# Altium schematic sheet Optical_RX.SchDoc
size A4; Organization: UltraZohm; SheetNumber: 3; SheetTotal: 3; Website: www.ultrazohm.com
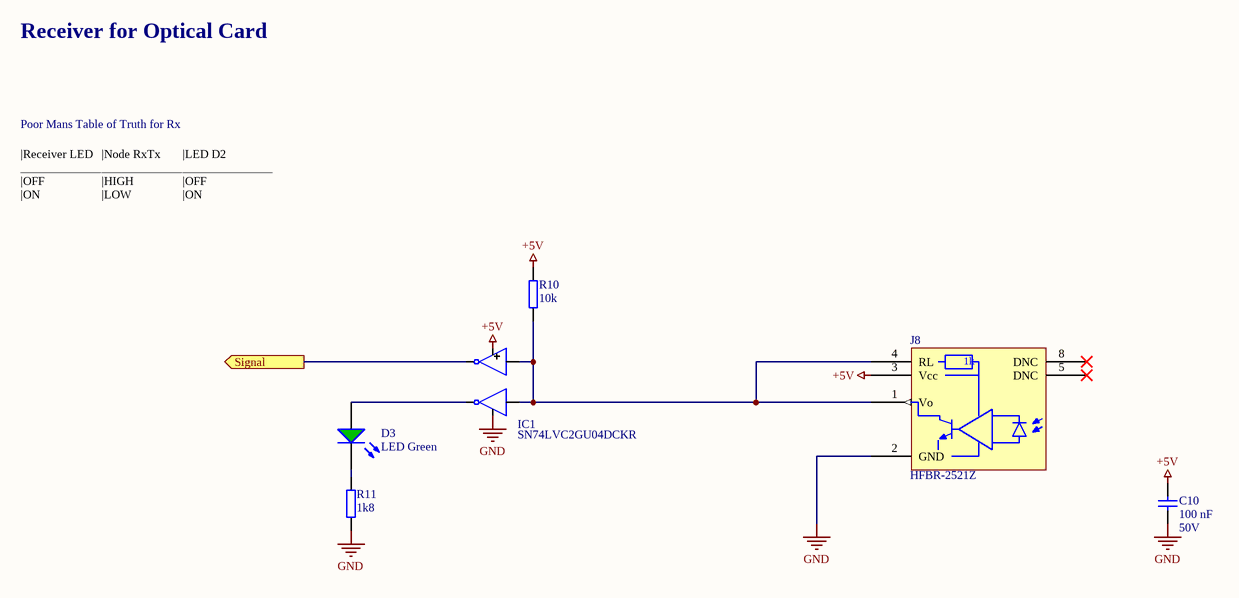
[diagram p0: Optical_RX.SchDoc]

## Parts
C10  Voltage: 50V  [C_0603_TE]  (hidden comment: 100 nF)
D3  LED Green  [WL-SMCW_0603]
IC1  SN74LVC2GU04DCKR  [SN74LVC2GU04DCKR]
J8  HFBR-2521Z  [HFBRx5XX]
R10  10k  [R_0603_TE]
R11  1k8  [R_0603_TE]

## Ports
Signal (out, see TopSheet[2A])

## Nets
+5V: C10.2 IC1.5(VCC) J8.3(Vcc) R10.1
GND: C10.1 IC1.2(GND) J8.2(GND) R11.2
Signal: IC1.6(OUT2) ; port Signal
NetD3_1: D3.1(K) R11.1
NetD3_2: D3.2(A) IC1.4(OUT2)
NetIC1_1: IC1.1(IN1) IC1.3(IN2) J8.1(Vo) J8.4(RL) R10.2

Not connected (* = marked no-connect by the designer): J8 5(DNC)* 8(DNC)*

## Notes on the sheet
- Receiver for Optical Card
- Poor Mans Table of Truth for Rx
- |Receiver LED
  ________________
  |OFF
  |ON
- |Node RxTx
  _________________
  |HIGH
  |LOW
- |LED D2
  _______________
  |OFF
  |ON
- GATE
  _______
  LOW
  HIGH
- Title
- Revision:
- Design Engineer:
- Date:
- Project:
- Sheet
- of
- (in symbol HFBR-2521Z) 1k

## Library data of the parts
C10 = UZgen_C_0603_100nF_50V_X7R: Generic capacitor; Manufacturer: UZgen; Tolerance: 10 %; Created from: AGeiger; Manufacturer Part Number: UZgen_C_0603_100nF_50V_X7R; PartID: 1; Created On: 02.07.2024 14:42:23; Value: 100 nF; Device Package: 0603; Technology: X7R; Mounting Type: SMD; Last Updated: 08.08.2024 15:01:15
D3 = 19-217/GHC-YR1S2/3T: LED GREEN 520~535NM 112~258MCD@20MA TOP VIEW 0603 ROHS; Manufacturer: Everlight Elec; Type: Standard; Created from: T. Wendt; Forward Current I_f: 20 mA; Forward Voltage U_f: 3.3 V; Wavelength: 530 nm; Light Intensity: 285 mcd; Nominal Power: 83 mW; Manufacturer Part Number: 19-217/GHC-YR1S2/3T; PartID: 7; Created On: 03.03.2021 10:06:23; ComponentLink1Description: Datasheet; ComponentLink1URL: https://datasheet.lcsc.com/szlcsc/Everlight-Elec-19-217-GHC-YR1S2-3T_C72043.pdf; Component Type: LED Diode; Device Package: 0603; Last Updated: 04.03.2021 09:02:49; Mounting Type: SMD; Operating Temperature: -40 - 85 °C; Supplier 1: LCSC; Supplier Part Number 1: C72043; Supplier 2: Mouser; Supplier Part Number 2: 638-19217GHCYR1S23T; Live Cycle Status: 1; Stock number: not stored; Color: green; LCSC Part Number: C72043
IC1 = SN74LVC2GU04DCKR: Dual inverter designed for 1.65-V to 5.5-V VCC operation.; Manufacturer: Texas Instruments; Value: 1.65 - 5.5 V; Created from: N.Diringer; Manufacturer Part Number: SN74LVC2GU04DCKR; PartID: 9; Created On: 18.12.2025 10:20:13; ComponentLink1Description: Datasheet; ComponentLink1URL: https://www.ti.com/product/SN74LVC2GU04; Component Type: Dual Inverter; Device Package: 0603 3-Pin; Last Updated: 18.12.2025 10:20:13; Mounting Type: SMD; Operating Temperature: -40 to 125; Series: SN74LVC2GU04DCKR; Supplier 1: Mouser; Supplier Part Number 1: 595-SN74LVC2GU04DCKR; Supplier 2: LCSC; Supplier Part Number 2: C116660; Type: Inverter; Live Cycle Status: 1; Stock number: not stored; LCSC Part Number: C116660
J8 = HFBR-2521Z: Fibre Optic Receivers, LINK HORIZ 5MBd RC VR RoHS; Suppier Part Number 2: 516-2062-ND; Manufacturer: Broadcom; MF: Boadcom/Avago; Wavelength: 660 nm; Iout max: 25 mA; Supply Voltage: 5V; Created from: VStarost; Created: 2019_04_09_Kreppel; MPN: HFBR-2521Z; Data Rate: 5 MBd; Supplier 1: Mouser; Supplier 2: Digi-Key; Supplier Part Number 1: 630-HFBR-2521Z; Manufacturer Part Number: HFBR-2521Z; PartID: 1; Created On: 27.12.2022 09:44:37; ComponentLink1Description: Datasheet; ComponentLink1URL: https://datasheet.ciiva.com/19453/1584669-19453911.pdf?src-supplier=Jameco; Component Type: LWL Receiver; Device Package: THT; Last Updated: 27.12.2022 09:44:37; Mounting Type: THT; Series: HFBR; Type: LWL Receiver; Live Cycle Status: 1; Stock number: not stored
R10 = UZgen_R_0603_10k: Generic resistor; Manufacturer: UZgen; Tolerance: 1 %; Created from: AGeiger; Manufacturer Part Number: UZgen_R_0603_10k; PartID: 1; Created On: 02.07.2024 14:34:53; Value: 10k; Device Package: 0603; Mounting Type: SMD; Last Updated: 02.07.2024 14:37:16; LCSC Part Number: C25804
R11 = UZgen_R_0603_1k8: Generic resistor; Manufacturer: UZgen; Tolerance: 1 %; Created from: UZgenTool; Manufacturer Part Number: UZgen_R_0603_1k8; PartID: 227; Created On: 02.07.2024 17:29:49; Value: 1k8; Device Package: 0603; Mounting Type: SMD; Last Updated: 02.07.2024 17:29:49; LCSC Part Number: C4177